# Altium schematic sheet Sheet.SchDoc
size A4
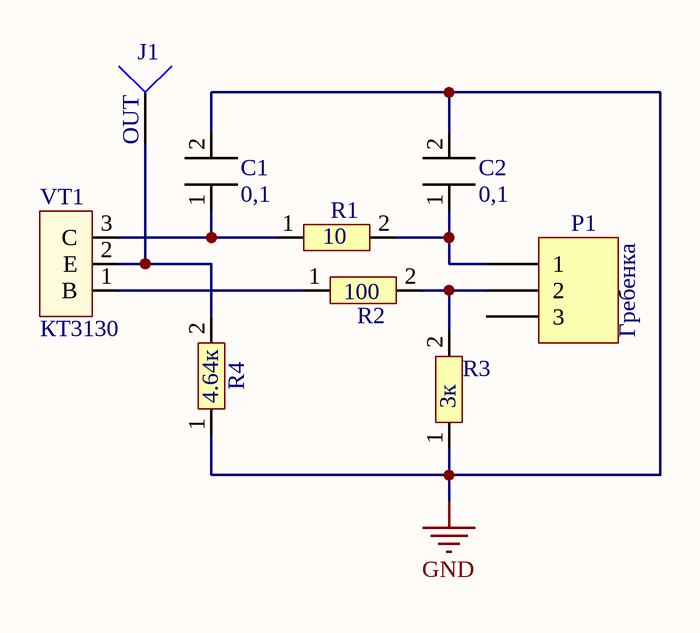
[diagram p0: Sheet.SchDoc]

## Parts
C1  0,1  [CAP_SMALL]
C2  0,1  [CAP_SMALL]
J1  OUT  [PIN1]
P1  Гребенка  [HDR1X3]
R1  10  [RES]
R2  100  [RES]
R3  3к  [RES]
R4  4.64к  [RES]
VT1  КТ3130  [SOT23-BEC_MMBT3640*(Primary)]

## Nets
GND: C1.2 C2.2 R3.1 R4.1
NetC1_1: C1.1 R1.1 VT1.3(C)
NetC2_1: C2.1 P1.1 R1.2
NetJ1_1: J1.1 R4.2 VT1.2(E)
NetP1_2: P1.2 R2.2 R3.2
NetR2_1: R2.1 VT1.1(B)

Not connected (* = marked no-connect by the designer): P1 3

## Library data of the parts
C1 C2 = CAP_SMALL
J1 = Socket: LatestRevisionDate: 17-Jul-2002; LatestRevisionNote: Re-released for DXP Platform.; Publisher: Altium Limited
P1 = Header 3: Header, 3-Pin; LatestRevisionDate: 17-Jul-2002; LatestRevisionNote: Re-released for DXP Platform.; Publisher: Altium Limited
R1-R4 = RES
VT1 = MMBT3640